# EAGLE schematic Send3 (EAGLE 6.5.0)

## Sheet 1 of 7
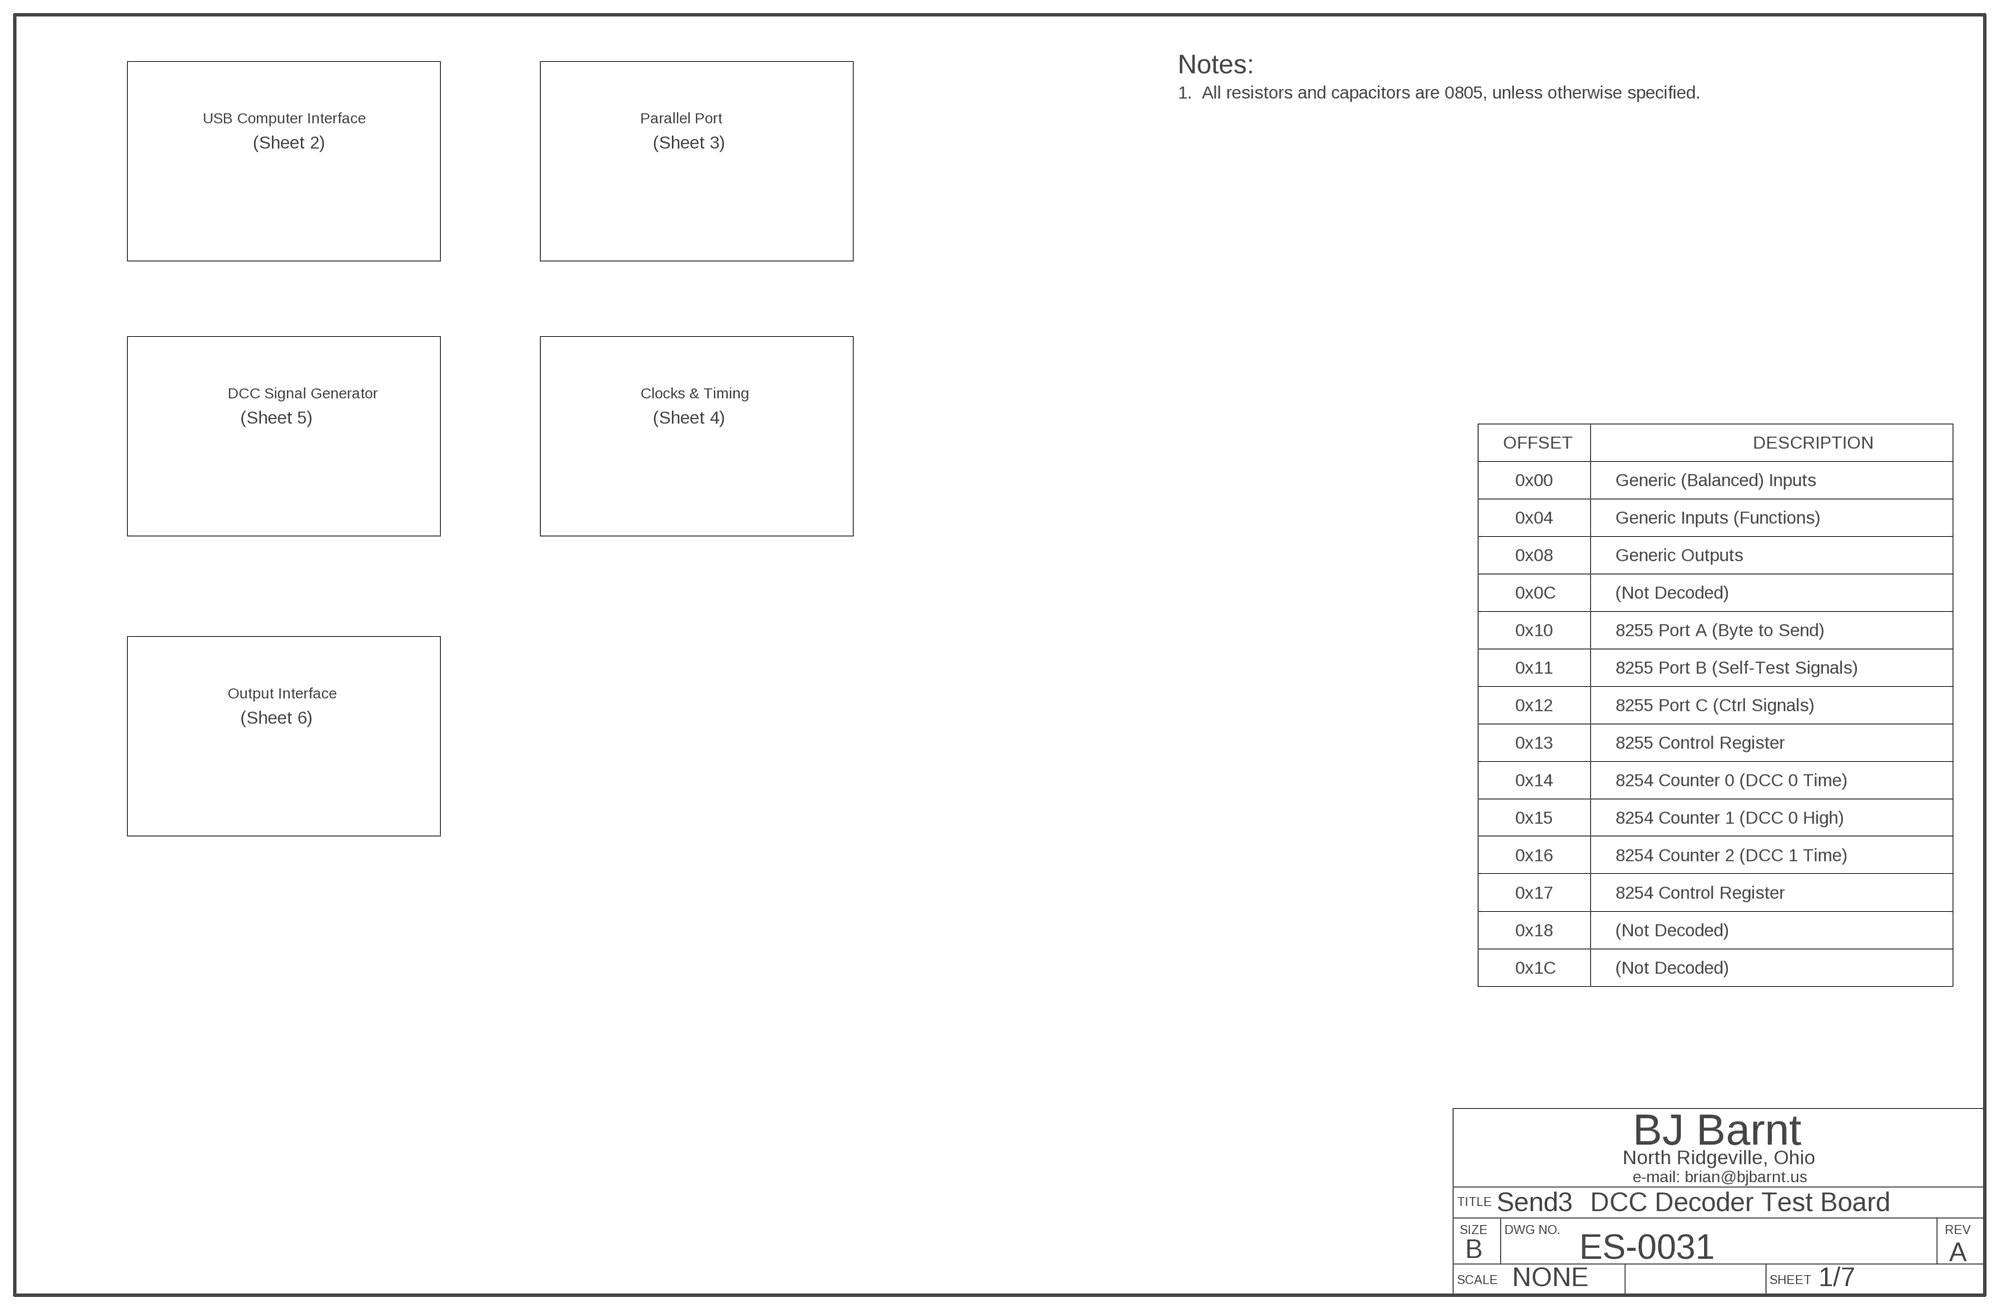
[diagram p0: schematic, sheet 1]

### Notes on the sheet
- Notes:
- 1.  All resistors and capacitors are 0805, unless otherwise specified.
- USB Computer Interface | Parallel Port
- (Sheet 2) | (Sheet 3)
- DCC Signal Generator | Clocks & Timing
- (Sheet 5) | (Sheet 4)
- OFFSET | DESCRIPTION
- 0x00 | Generic (Balanced) Inputs
- 0x04 | Generic Inputs (Functions)
- 0x08 | Generic Outputs
- 0x0C | (Not Decoded)
- 0x10 | 8255 Port A (Byte to Send)
- 0x11 | 8255 Port B (Self-Test Signals)
- Output Interface
- 0x12 | 8255 Port C (Ctrl Signals)
- (Sheet 6)
- 0x13 | 8255 Control Register
- 0x14 | 8254 Counter 0 (DCC 0 Time)
- 0x15 | 8254 Counter 1 (DCC 0 High)
- 0x16 | 8254 Counter 2 (DCC 1 Time)
- 0x17 | 8254 Control Register
- 0x18 | (Not Decoded)
- 0x1C | (Not Decoded)
- DCC Decoder Test Board
- ES-0031 | A

## Sheet 2 of 7
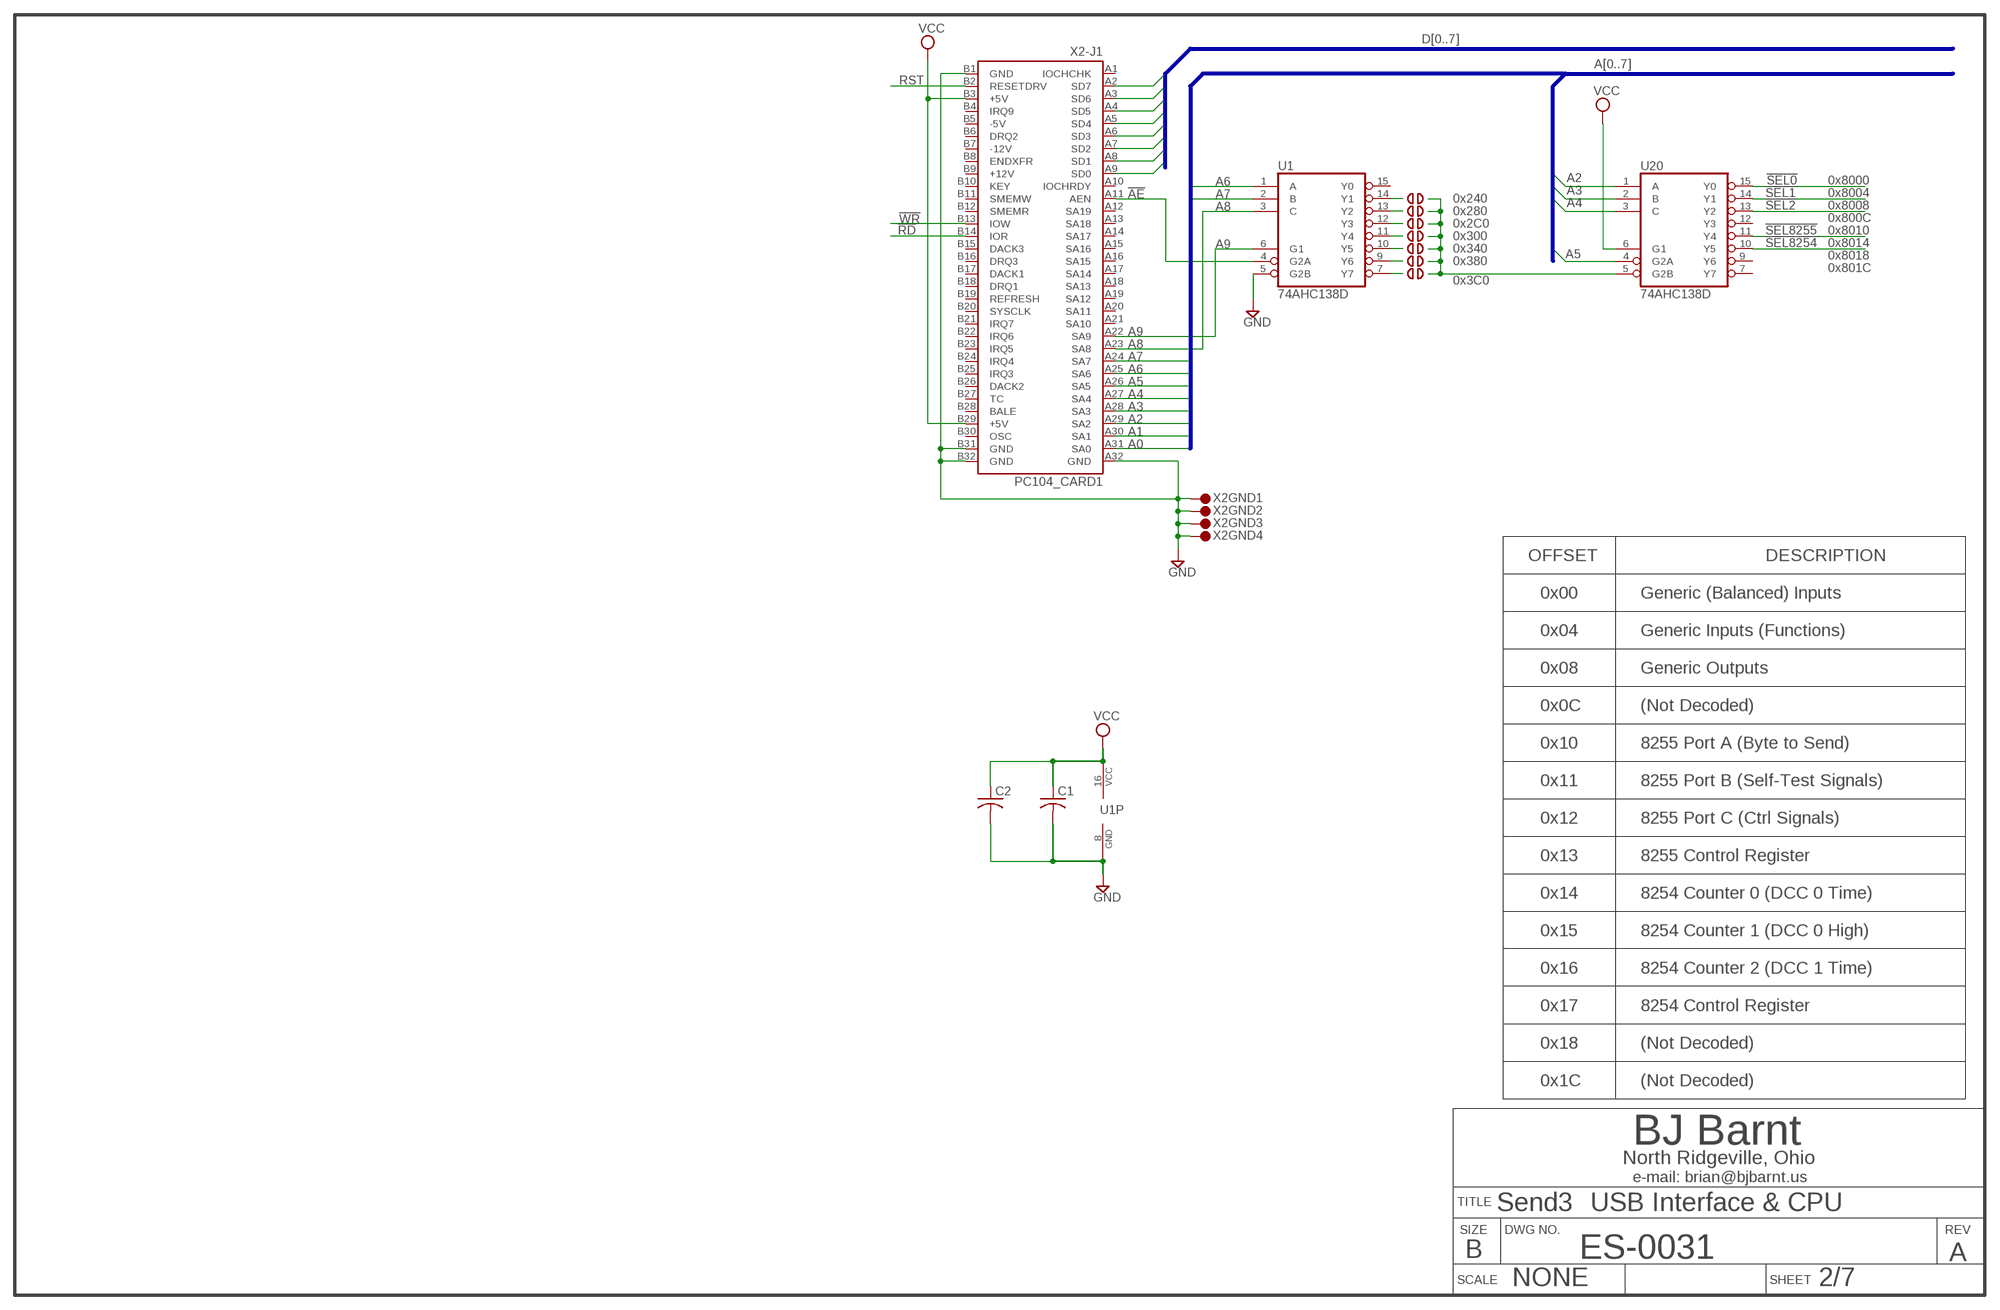
[diagram p1: schematic, sheet 2]

### Parts
C1  C-USC0805K  [C0805K]
C2  C-USC0805K  [C0805K]
JMPR2  JUMPER  [SOLDER_BRIDGE]
JMPR3  JUMPER  [SOLDER_BRIDGE]
JMPR4  JUMPER  [SOLDER_BRIDGE]
JMPR5  JUMPER  [SOLDER_BRIDGE]
JMPR6  JUMPER  [SOLDER_BRIDGE]
JMPR7  JUMPER  [SOLDER_BRIDGE]
JMPR8  JUMPER  [SOLDER_BRIDGE]
U1  74AHC138D  [SO16]
U20  74AHC138D  [SO16]
X2  PC104_CARD1  [PC104-STANDARD]

### Nets
!AE: U1.4(G2A) X2.A11(-J1:AEN)
!RD: X2.B14(-J1:IOR) ; also sheet 3,4
!SEL0: U20.15(Y0) ; also sheet 3
!SEL1: U20.14(Y1) ; also sheet 3
!SEL2: U20.13(Y2) ; also sheet 3
!SEL8254: U20.10(Y5) ; also sheet 4
!SEL8255: U20.11(Y4) ; also sheet 3
!WR: X2.B13(-J1:IOW) ; also sheet 3,4
A0: X2.A31(-J1:SA0) ; also sheet 3,4
A1: X2.A30(-J1:SA1) ; also sheet 3,4
A2: U20.1(A) X2.A29(-J1:SA2)
A3: U20.2(B) X2.A28(-J1:SA3)
A4: U20.3(C) X2.A27(-J1:SA4)
A5: U20.4(G2A) X2.A26(-J1:SA5)
A6: U1.1(A) X2.A25(-J1:SA6)
A7: U1.2(B) X2.A24(-J1:SA7)
A8: U1.3(C) X2.A23(-J1:SA8)
A9: U1.6(G1) X2.A22(-J1:SA9)
D0: X2.A9(-J1:SD0) ; also sheet 3,4,6
D1: X2.A8(-J1:SD1) ; also sheet 3,4,6
D2: X2.A7(-J1:SD2) ; also sheet 3,4,6
D3: X2.A6(-J1:SD3) ; also sheet 3,4,6
D4: X2.A5(-J1:SD4) ; also sheet 3,4,6
D5: X2.A4(-J1:SD5) ; also sheet 3,4,6
D6: X2.A3(-J1:SD6) ; also sheet 3,4,6
D7: X2.A2(-J1:SD7) ; also sheet 3,4,6
GND: C1.2 C2.2 U1.5(G2B) U1.8(GND) X2.A32(-J1:GND) X2.B1(-J1:GND) X2.B31(-J1:GND) X2.B32(-J1:GND) X2.GND@1 X2.GND@2 X2.GND@3 X2.GND@4 ; also sheet 3,4,5,6
N$2: JMPR2.P$1 U1.14(Y1)
N$3: JMPR3.P$1 U1.13(Y2)
N$4: JMPR4.P$1 U1.12(Y3)
N$6: JMPR5.P$1 U1.11(Y4)
N$7: JMPR6.P$1 U1.10(Y5)
N$8: JMPR7.P$1 U1.9(Y6)
N$11: JMPR8.P$1 U1.7(Y7)
N$12: JMPR2.P$2 JMPR3.P$2 JMPR4.P$2 JMPR5.P$2 JMPR6.P$2 JMPR7.P$2 JMPR8.P$2 U20.5(G2B)
RST: X2.B2(-J1:RESETDRV) ; also sheet 3
VCC: C1.1 C2.1 U1.16(VCC) U20.6(G1) X2.B3(-J1:+5V) X2.B29(-J1:+5V) ; also sheet 3,4,5,6
Unconnected: U1.15(Y0) U20.7(Y7) U20.9(Y6) U20.12(Y3) X2.A1(-J1:IOCHCHK) X2.A10(-J1:IOCHRDY) X2.A12(-J1:SA19) X2.A13(-J1:SA18) X2.A14(-J1:SA17) X2.A15(-J1:SA16) X2.A16(-J1:SA15) X2.A17(-J1:SA14) X2.A18(-J1:SA13) X2.A19(-J1:SA12) X2.A20(-J1:SA11) X2.A21(-J1:SA10) X2.B4(-J1:IRQ9) X2.B5(-J1:-5V) X2.B6(-J1:DRQ2) X2.B7(-J1:-12V) X2.B8(-J1:ENDXFR) X2.B9(-J1:+12V) X2.B10(-J1:KEY) X2.B11(-J1:SMEMW) X2.B12(-J1:SMEMR) X2.B15(-J1:DACK3) X2.B16(-J1:DRQ3) X2.B17(-J1:DACK1) X2.B18(-J1:DRQ1) X2.B19(-J1:REFRESH) X2.B20(-J1:SYSCLK) X2.B21(-J1:IRQ7) X2.B22(-J1:IRQ6) X2.B23(-J1:IRQ5) X2.B24(-J1:IRQ4) X2.B25(-J1:IRQ3) X2.B26(-J1:DACK2) X2.B27(-J1:TC) X2.B28(-J1:BALE) X2.B30(-J1:OSC) X2.C0(-J2:0V) X2.C1(-J2:SBHE) X2.C2(-J2:LA23) X2.C3(-J2:LA22) X2.C4(-J2:LA21) X2.C5(-J2:LA20) X2.C6(-J2:LA19) X2.C7(-J2:LA18) X2.C8(-J2:LA17) X2.C9(-J2:MEMR) X2.C10(-J2:MEMW) X2.C11(-J2:SD8) X2.C12(-J2:SD9) X2.C13(-J2:SD10) X2.C14(-J2:SD11) X2.C15(-J2:SD12) X2.C16(-J2:SD13) X2.C17(-J2:SD14) X2.C18(-J2:SD15) X2.C19(-J2:KEY) X2.D0(-J2:0V) X2.D1(-J2:MEMCS16) X2.D2(-J2:IOCS16) X2.D3(-J2:IRQ10) X2.D4(-J2:IRQ11) X2.D5(-J2:IRQ12) X2.D6(-J2:IRQ15) X2.D7(-J2:IRQ14) X2.D8(-J2:DACK0) X2.D9(-J2:DRQ0) X2.D10(-J2:DACK5) X2.D11(-J2:DRQ5) X2.D12(-J2:DACK6) X2.D13(-J2:DRQ6) X2.D14(-J2:DACK7) X2.D15(-J2:DRQ7) X2.D16(-J2:+5V) X2.D17(-J2:MASTER) X2.D18(-J2:0V) X2.D19(-J2:0V)

### Buses
D[0..7]
A[0..7]

### Notes on the sheet
- 0x8000
- 0x240 | 0x8004
- 0x280 | 0x8008
- 0x2C0 | 0x800C
- 0x300 | 0x8010
- 0x340 | 0x8014
- 0x380 | 0x8018
- 0x801C
- 0x3C0
- OFFSET | DESCRIPTION
- 0x00 | Generic (Balanced) Inputs
- 0x04 | Generic Inputs (Functions)
- 0x08 | Generic Outputs
- 0x0C | (Not Decoded)
- 0x10 | 8255 Port A (Byte to Send)
- 0x11 | 8255 Port B (Self-Test Signals)
- 0x12 | 8255 Port C (Ctrl Signals)
- 0x13 | 8255 Control Register
- 0x14 | 8254 Counter 0 (DCC 0 Time)
- 0x15 | 8254 Counter 1 (DCC 0 High)
- 0x16 | 8254 Counter 2 (DCC 1 Time)
- 0x17 | 8254 Control Register
- 0x18 | (Not Decoded)
- 0x1C | (Not Decoded)
- USB Interface & CPU
- ES-0031 | A

## Sheet 3 of 7
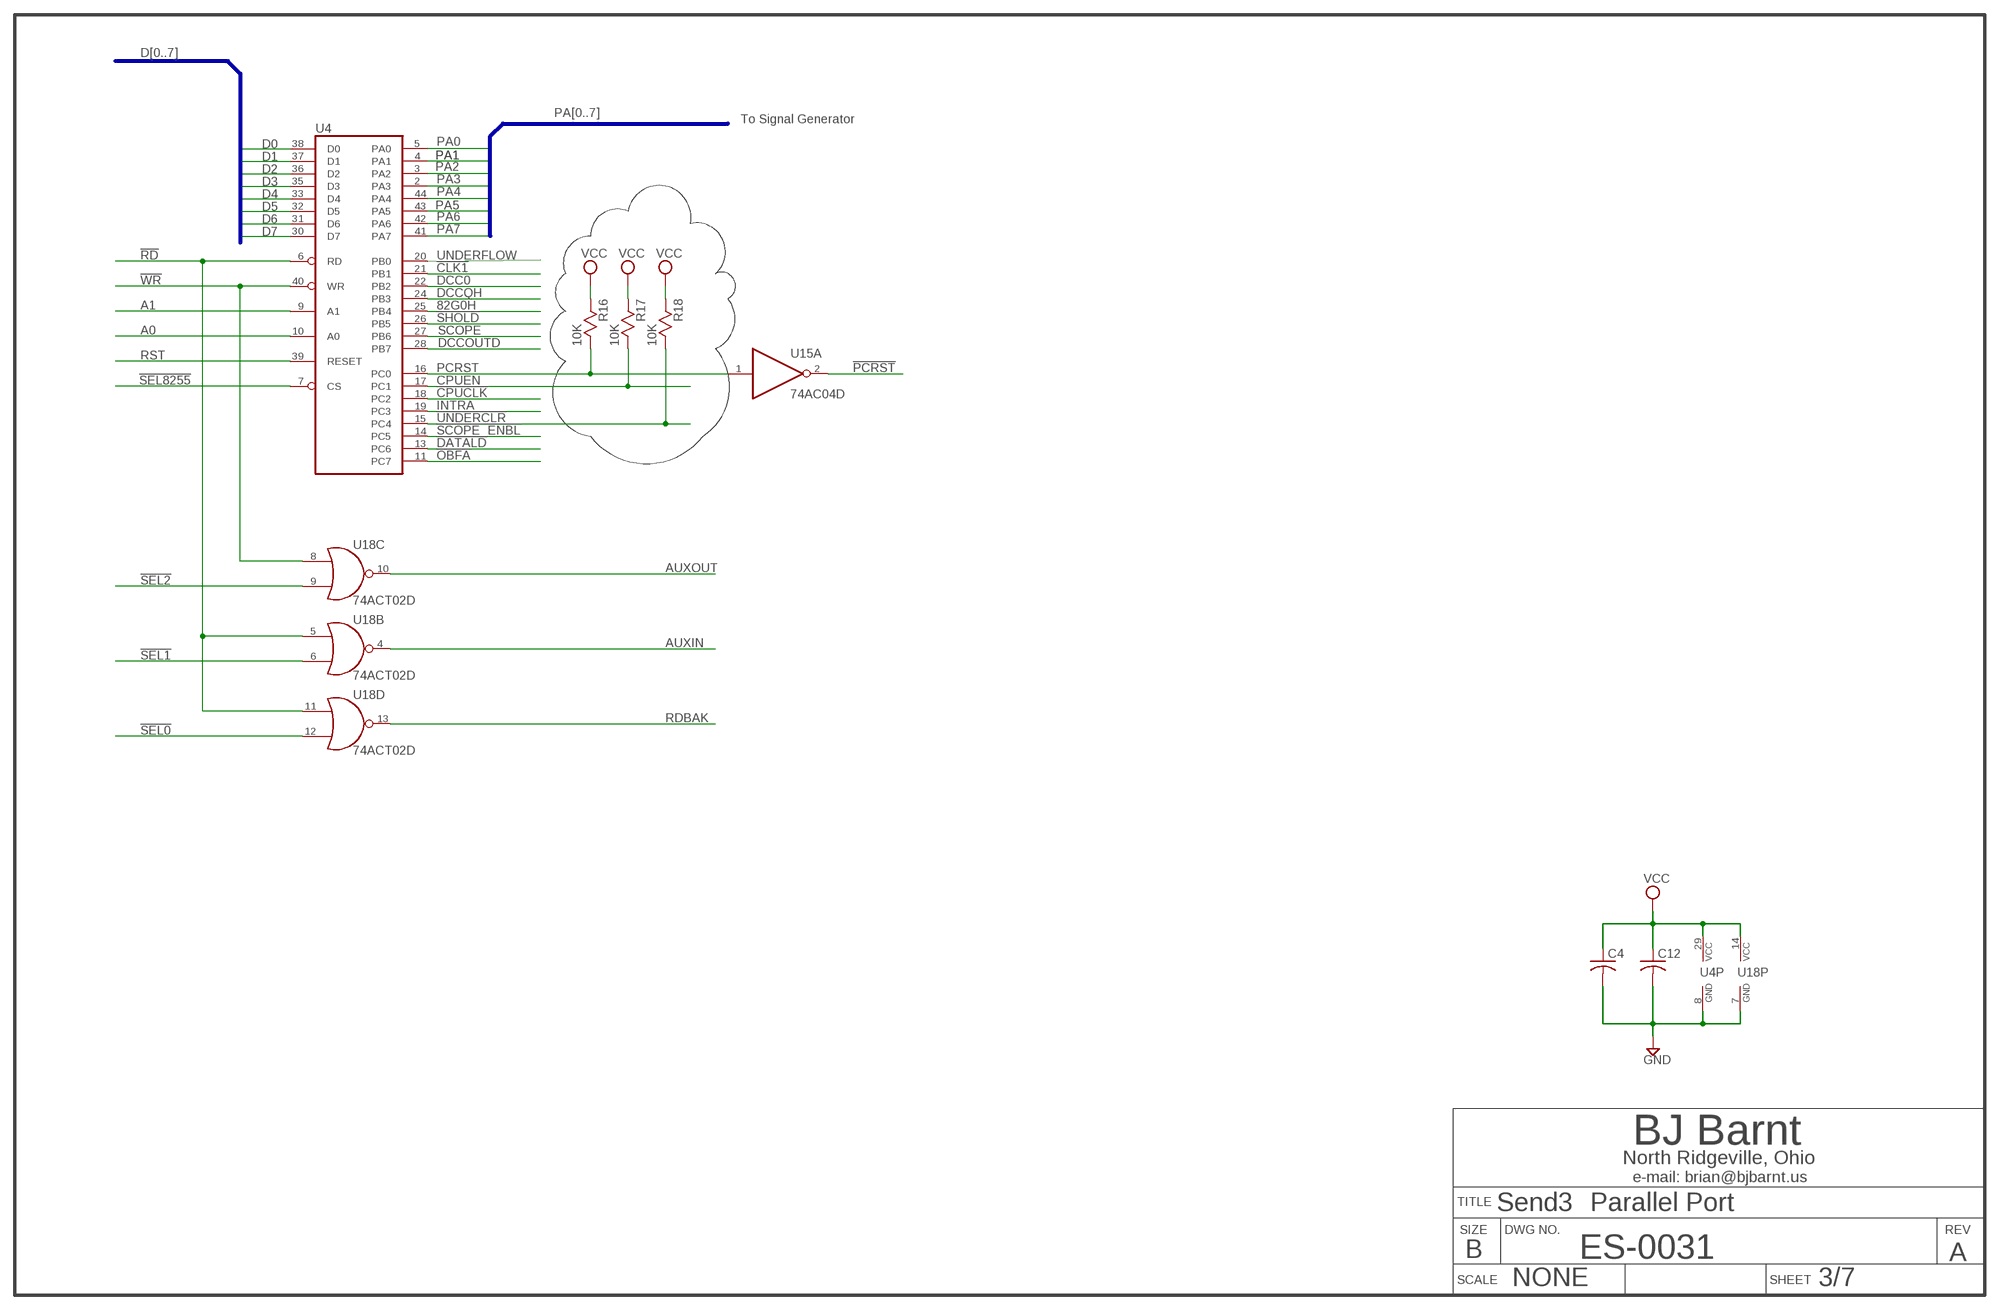
[diagram p2: schematic, sheet 3]

### Parts
C4  C-USC0805K  [C0805K]
C12  C-USC0805K  [C0805K]
R16  10K  R-US_0805W  [R0805W]
R17  10K  R-US_0805W  [R0805W]
R18  10K  R-US_0805W  [R0805W]
U4  8255A-S  [PLCC44]
U15  74AC04D  [SO14]
U18  74ACT02D  [SO14]

### Nets
82G0H: U4.25(PB4) ; also sheet 4,5
!CLK1: U4.21(PB1) ; also sheet 4,5
!CPUCLK: U4.18(PC2) ; also sheet 4
!DATALD: U4.13(PC6) ; also sheet 5
!OBFA: U4.11(PC7) ; also sheet 5
!PCRST: U15.2(A:O) ; also sheet 4,5,6
!RD: U4.6(RD) U18.5(B:I0) U18.11(D:I0) ; also sheet 2,4
!SCOPE_ENBL: U4.14(PC5) ; also sheet 5
!SEL0: U18.12(D:I1) ; also sheet 2
!SEL1: U18.6(B:I1) ; also sheet 2
!SEL2: U18.9(C:I1) ; also sheet 2
!SEL8255: U4.7(CS) ; also sheet 2
!SHOLD: U4.26(PB5) ; also sheet 5
!UNDERCLR: R18.2 U4.15(PC4) ; also sheet 5
!WR: U4.40(WR) U18.8(C:I0) ; also sheet 2,4
A0: U4.10(A0) ; also sheet 2,4
A1: U4.9(A1) ; also sheet 2,4
AUXIN: U18.4(B:O) ; also sheet 6
AUXOUT: U18.10(C:O) ; also sheet 6
CPUEN: R17.2 U4.17(PC1) ; also sheet 4
D0: U4.38(D0) ; also sheet 2,4,6
D1: U4.37(D1) ; also sheet 2,4,6
D2: U4.36(D2) ; also sheet 2,4,6
D3: U4.35(D3) ; also sheet 2,4,6
D4: U4.33(D4) ; also sheet 2,4,6
D5: U4.32(D5) ; also sheet 2,4,6
D6: U4.31(D6) ; also sheet 2,4,6
D7: U4.30(D7) ; also sheet 2,4,6
DCC0: U4.22(PB2) ; also sheet 4
DCCOUTD: U4.28(PB7) ; also sheet 5,6
DCCQH: U4.24(PB3) ; also sheet 4,5
GND: C4.2 C12.2 U4.8(GND) U18.7(P:GND) ; also sheet 2,4,5,6
INTRA: U4.19(PC3)
PA0: U4.5(PA0) ; also sheet 5
PA1: U4.4(PA1) ; also sheet 5
PA2: U4.3(PA2) ; also sheet 5
PA3: U4.2(PA3) ; also sheet 5
PA4: U4.44(PA4) ; also sheet 5
PA5: U4.43(PA5) ; also sheet 5
PA6: U4.42(PA6) ; also sheet 5
PA7: U4.41(PA7) ; also sheet 5
PCRST: R16.2 U4.16(PC0) U15.1(A:I)
RDBAK: U18.13(D:O) ; also sheet 6
RST: U4.39(RESET) ; also sheet 2
SCOPE: U4.27(PB6) ; also sheet 5,6
UNDERFLOW: U4.20(PB0) ; also sheet 5
VCC: C4.1 C12.1 R16.1 R17.1 R18.1 U4.29(VCC) U18.14(P:VCC) ; also sheet 2,4,5,6
Unconnected: U15.12(F:O) U15.13(F:I) U18.1(A:O) U18.2(A:I0) U18.3(A:I1)

### Buses
D[0..7]
PA[0..7]

### Notes on the sheet
- To Signal Generator
- Parallel Port
- ES-0031 | A

## Sheet 4 of 7
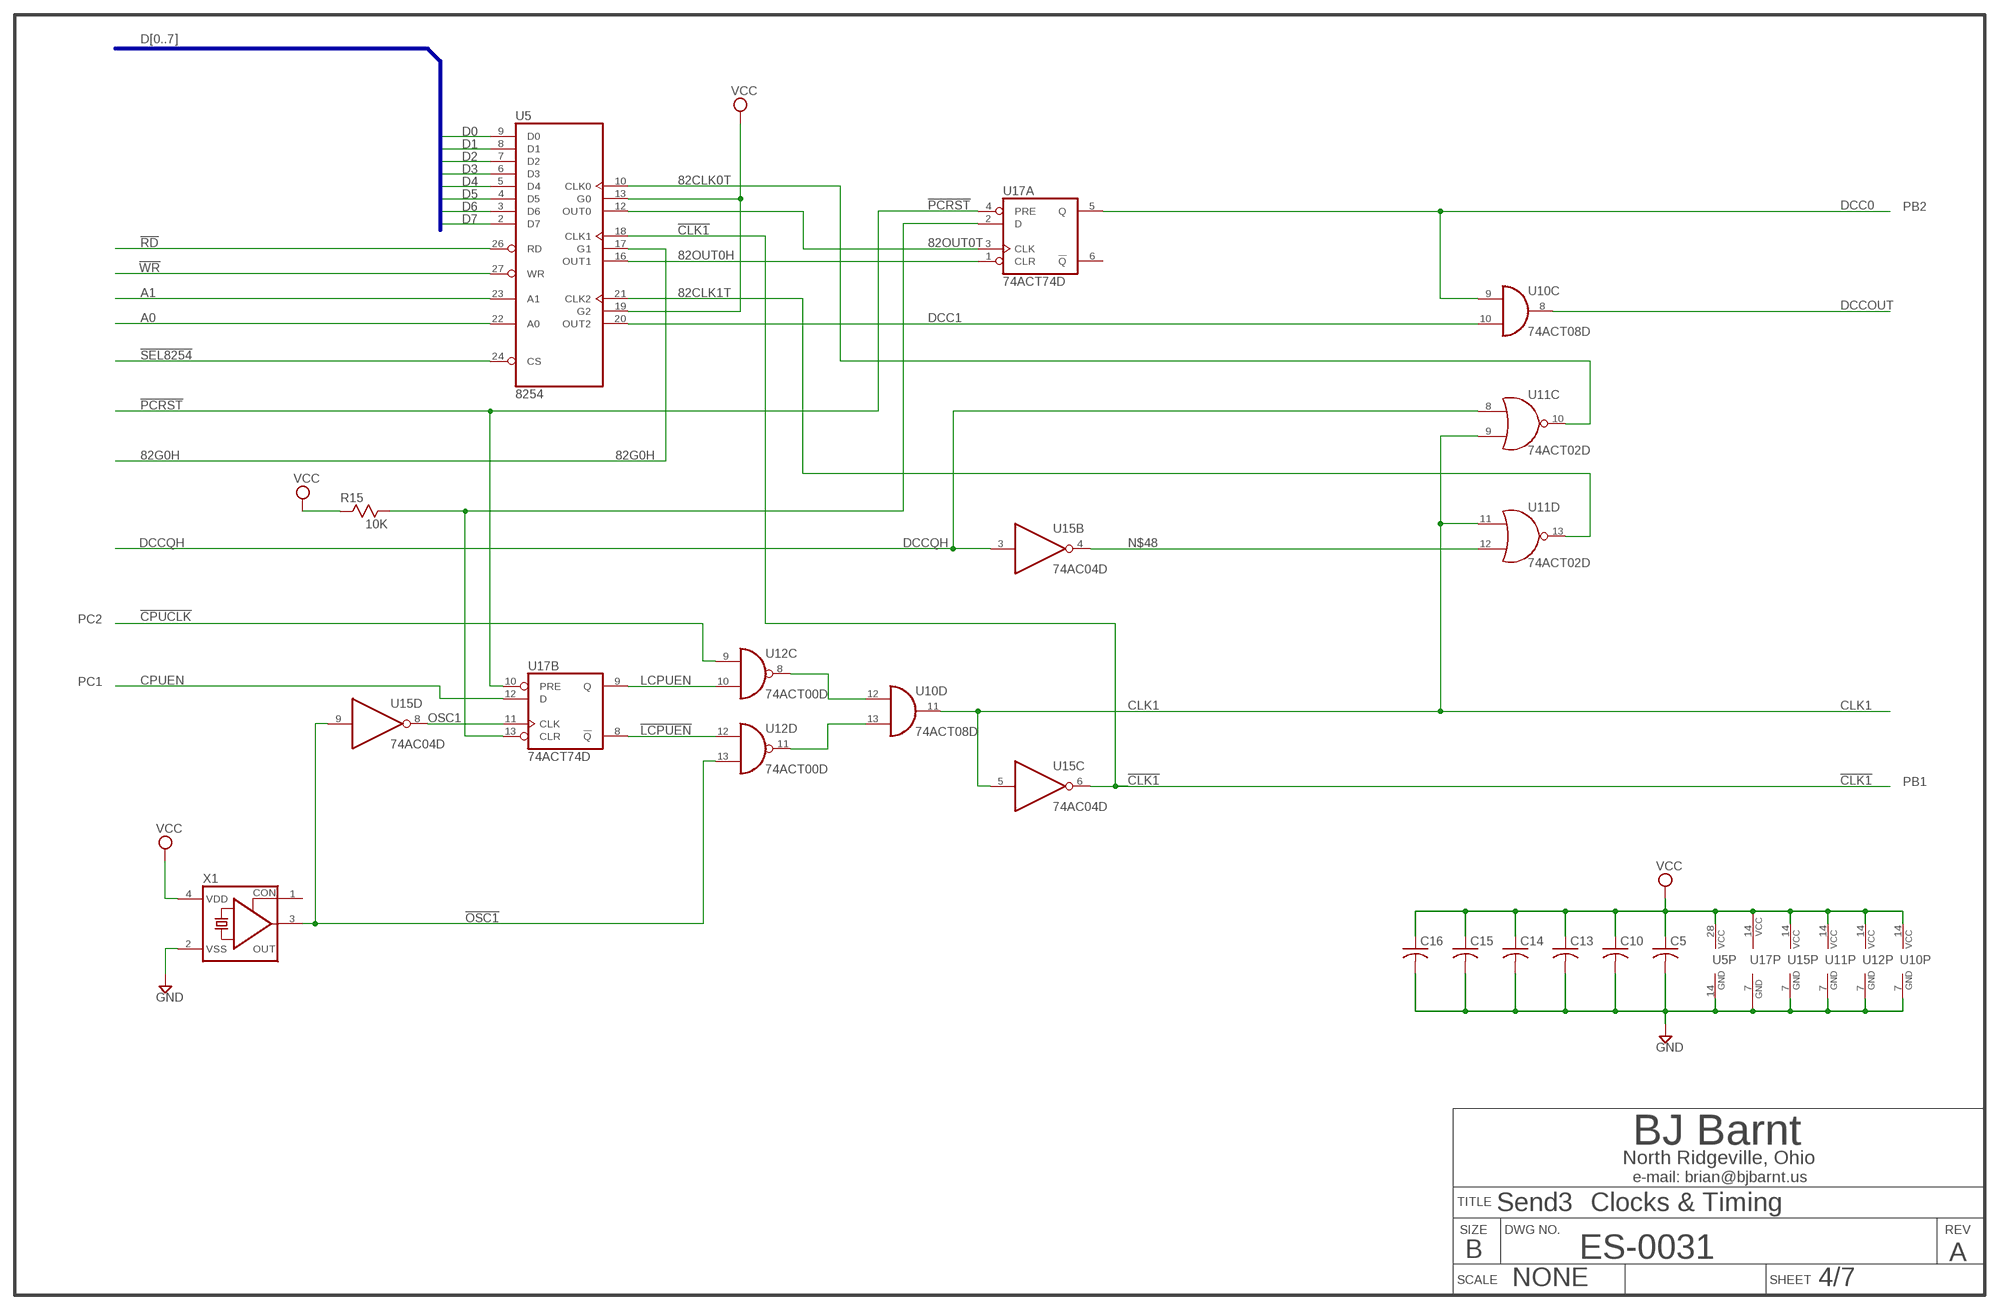
[diagram p3: schematic, sheet 4]

### Parts
C5  C-USC0805K  [C0805K]
C10  C-USC0805K  [C0805K]
C13  C-USC0805K  [C0805K]
C14  C-USC0805K  [C0805K]
C15  C-USC0805K  [C0805K]
C16  C-USC0805K  [C0805K]
R15  10K  R-US_0805W  [R0805W]
U5  8254  [PLCC28S]
U10  74ACT08D  74AC08D  [SO14]
U11  74ACT02D  74AC02D  [SO14]
U12  74ACT00D  74AC00D  [SO14]
U17  74ACT74D  7474D  [SO14]
X1  CRYSTAL_RES-1100S  [1100S]

### Nets
82CLK0T: U5.10(CLK0) U11.10(C:O)
82CLK1T: U5.21(CLK2) U11.13(D:O)
82G0H: U5.17(G1) ; also sheet 3,5
82OUT0H: U5.16(OUT1) U17.1(A:CLR)
82OUT0T: U5.12(OUT0) U17.3(A:CLK)
!CLK1: U5.18(CLK1) U15.6(C:O) ; also sheet 3,5
!CPUCLK: U12.9(C:I0) ; also sheet 3
!LCPUEN: U12.12(D:I0) U17.8(B:!Q)
!OSC1: U12.13(D:I1) U15.9(D:I) X1.3(OUT)
!PCRST: U17.4(A:PRE) U17.10(B:PRE) ; also sheet 3,5,6
!RD: U5.26(RD) ; also sheet 2,3
!SEL8254: U5.24(CS) ; also sheet 2
!WR: U5.27(WR) ; also sheet 2,3
A0: U5.22(A0) ; also sheet 2,3
A1: U5.23(A1) ; also sheet 2,3
CLK1: U10.11(D:O) U11.9(C:I1) U11.11(D:I0) U15.5(C:I) ; also sheet 5
CPUEN: U17.12(B:D) ; also sheet 3
D0: U5.9(D0) ; also sheet 2,3,6
D1: U5.8(D1) ; also sheet 2,3,6
D2: U5.7(D2) ; also sheet 2,3,6
D3: U5.6(D3) ; also sheet 2,3,6
D4: U5.5(D4) ; also sheet 2,3,6
D5: U5.4(D5) ; also sheet 2,3,6
D6: U5.3(D6) ; also sheet 2,3,6
D7: U5.2(D7) ; also sheet 2,3,6
DCC0: U10.9(C:I0) U17.5(A:Q) ; also sheet 3
DCC1: U5.20(OUT2) U10.10(C:I1)
DCCOUT: U10.8(C:O) ; also sheet 5
DCCQH: U11.8(C:I0) U15.3(B:I) ; also sheet 3,5
GND: C5.2 C10.2 C13.2 C14.2 C15.2 C16.2 U5.14(GND) U10.7(P:GND) U11.7(P:GND) U12.7(P:GND) U15.7(P:GND) U17.7(P:GND) X1.2(VSS) ; also sheet 2,3,5,6
LCPUEN: U12.10(C:I1) U17.9(B:Q)
N$42: U10.12(D:I0) U12.8(C:O)
N$43: U10.13(D:I1) U12.11(D:O)
N$48: U11.12(D:I1) U15.4(B:O)
OSC1: U15.8(D:O) U17.11(B:CLK)
PU403: R15.2 U17.2(A:D) U17.13(B:CLR)
VCC: C5.1 C10.1 C13.1 C14.1 C15.1 C16.1 R15.1 U5.13(G0) U5.19(G2) U5.28(VCC) U10.14(P:VCC) U11.14(P:VCC) U12.14(P:VCC) U15.14(P:VCC) U17.14(P:VCC) X1.4(VDD) ; also sheet 2,3,5,6
Unconnected: U17.6(A:!Q) X1.1(CON)

### Buses
D[0..7]

### Notes on the sheet
- PB2
- PC2
- PC1
- PB1
- Clocks & Timing
- ES-0031 | A

## Sheet 5 of 7
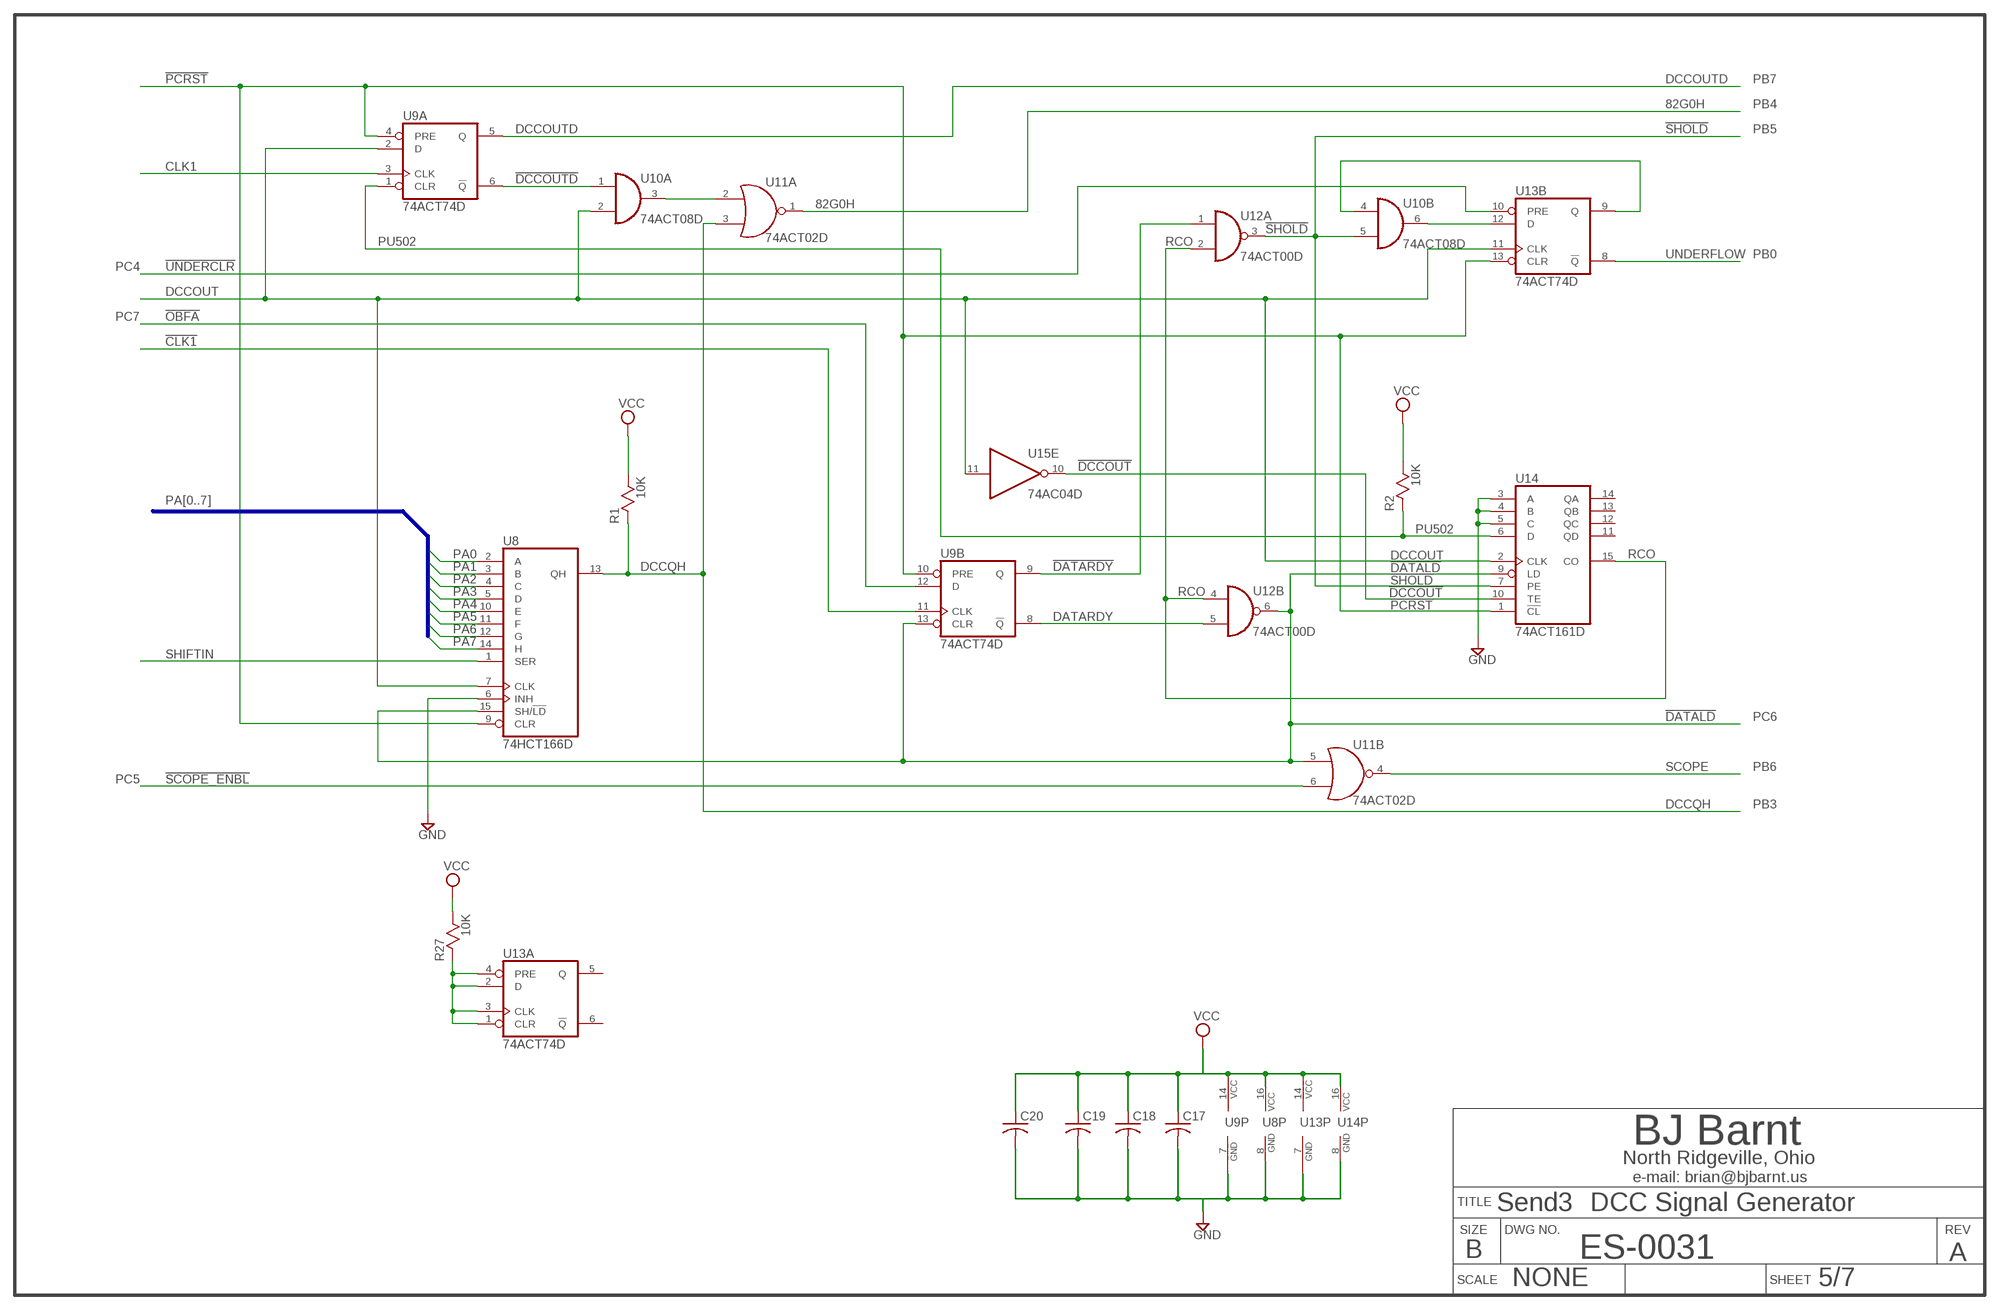
[diagram p4: schematic, sheet 5]

### Parts
C17  C-USC0805K  [C0805K]
C18  C-USC0805K  [C0805K]
C19  C-USC0805K  [C0805K]
C20  C-USC0805K  [C0805K]
R1  10K  R-US_0805W  [R0805W]
R2  10K  R-US_0805W  [R0805W]
R27  10K  R-US_0805W  [R0805W]
U8  74HCT166D  [SO16]
U9  74ACT74D  7474D  [SO14]
U13  74ACT74D  7474D  [SO14]
U14  74ACT161D  74161D  [SO16]

### Nets
82G0H: U11.1(A:O) ; also sheet 3,4
!CLK1: U9.11(B:CLK) ; also sheet 3,4
!DATALD: U8.15(SH/!LD) U9.13(B:CLR) U11.5(B:I0) U12.6(B:O) U14.9(LD) ; also sheet 3
!DATARDY: U9.9(B:Q) U12.1(A:I0)
!DCCOUT: U14.10(TE) U15.10(E:O)
!DCCOUTD: U9.6(A:!Q) U10.1(A:I0)
!OBFA: U9.12(B:D) ; also sheet 3
!PCRST: U8.9(CLR) U9.4(A:PRE) U9.10(B:PRE) U13.13(B:CLR) U14.1(!CL) ; also sheet 3,4,6
!SCOPE_ENBL: U11.6(B:I1) ; also sheet 3
!SHOLD: U10.5(B:I1) U12.3(A:O) U14.7(PE) ; also sheet 3
!UNDERCLR: U13.10(B:PRE) ; also sheet 3
CLK1: U9.3(A:CLK) ; also sheet 4
DATARDY: U9.8(B:!Q) U12.5(B:I1)
DCCOUT: U8.7(CLK) U9.2(A:D) U10.2(A:I1) U13.11(B:CLK) U14.2(CLK) U15.11(E:I) ; also sheet 4
DCCOUTD: U9.5(A:Q) ; also sheet 3,6
DCCQH: R1.1 U8.13(QH) U11.3(A:I1) ; also sheet 3,4
GND: C17.2 C18.2 C19.2 C20.2 U8.6(INH) U8.8(GND) U9.7(P:GND) U13.7(P:GND) U14.3(A) U14.4(B) U14.5(C) U14.8(GND) ; also sheet 2,3,4,6
N$5: U10.3(A:O) U11.2(A:I0)
N$9: U10.6(B:O) U13.12(B:D)
N$10: U10.4(B:I0) U13.9(B:Q)
N$50: R27.1 U13.1(A:CLR) U13.2(A:D) U13.3(A:CLK) U13.4(A:PRE)
PA0: U8.2(A) ; also sheet 3
PA1: U8.3(B) ; also sheet 3
PA2: U8.4(C) ; also sheet 3
PA3: U8.5(D) ; also sheet 3
PA4: U8.10(E) ; also sheet 3
PA5: U8.11(F) ; also sheet 3
PA6: U8.12(G) ; also sheet 3
PA7: U8.14(H) ; also sheet 3
PU502: R2.1 U9.1(A:CLR) U14.6(D)
RCO: U12.2(A:I1) U12.4(B:I0) U14.15(CO)
SCOPE: U11.4(B:O) ; also sheet 3,6
SHIFTIN: U8.1(SER) ; also sheet 6
UNDERFLOW: U13.8(B:!Q) ; also sheet 3
VCC: C17.1 C18.1 C19.1 C20.1 R1.2 R2.2 R27.2 U8.16(VCC) U9.14(P:VCC) U13.14(P:VCC) U14.16(VCC) ; also sheet 2,3,4,6
Unconnected: U13.5(A:Q) U13.6(A:!Q) U14.11(QD) U14.12(QC) U14.13(QB) U14.14(QA)

### Buses
PA[0..7]

### Notes on the sheet
- PB7
- PB4
- PB5
- PB0
- PC4
- PC7
- PC6
- PB6
- PC5
- PB3
- DCC Signal Generator
- ES-0031 | A

## Sheet 6 of 7
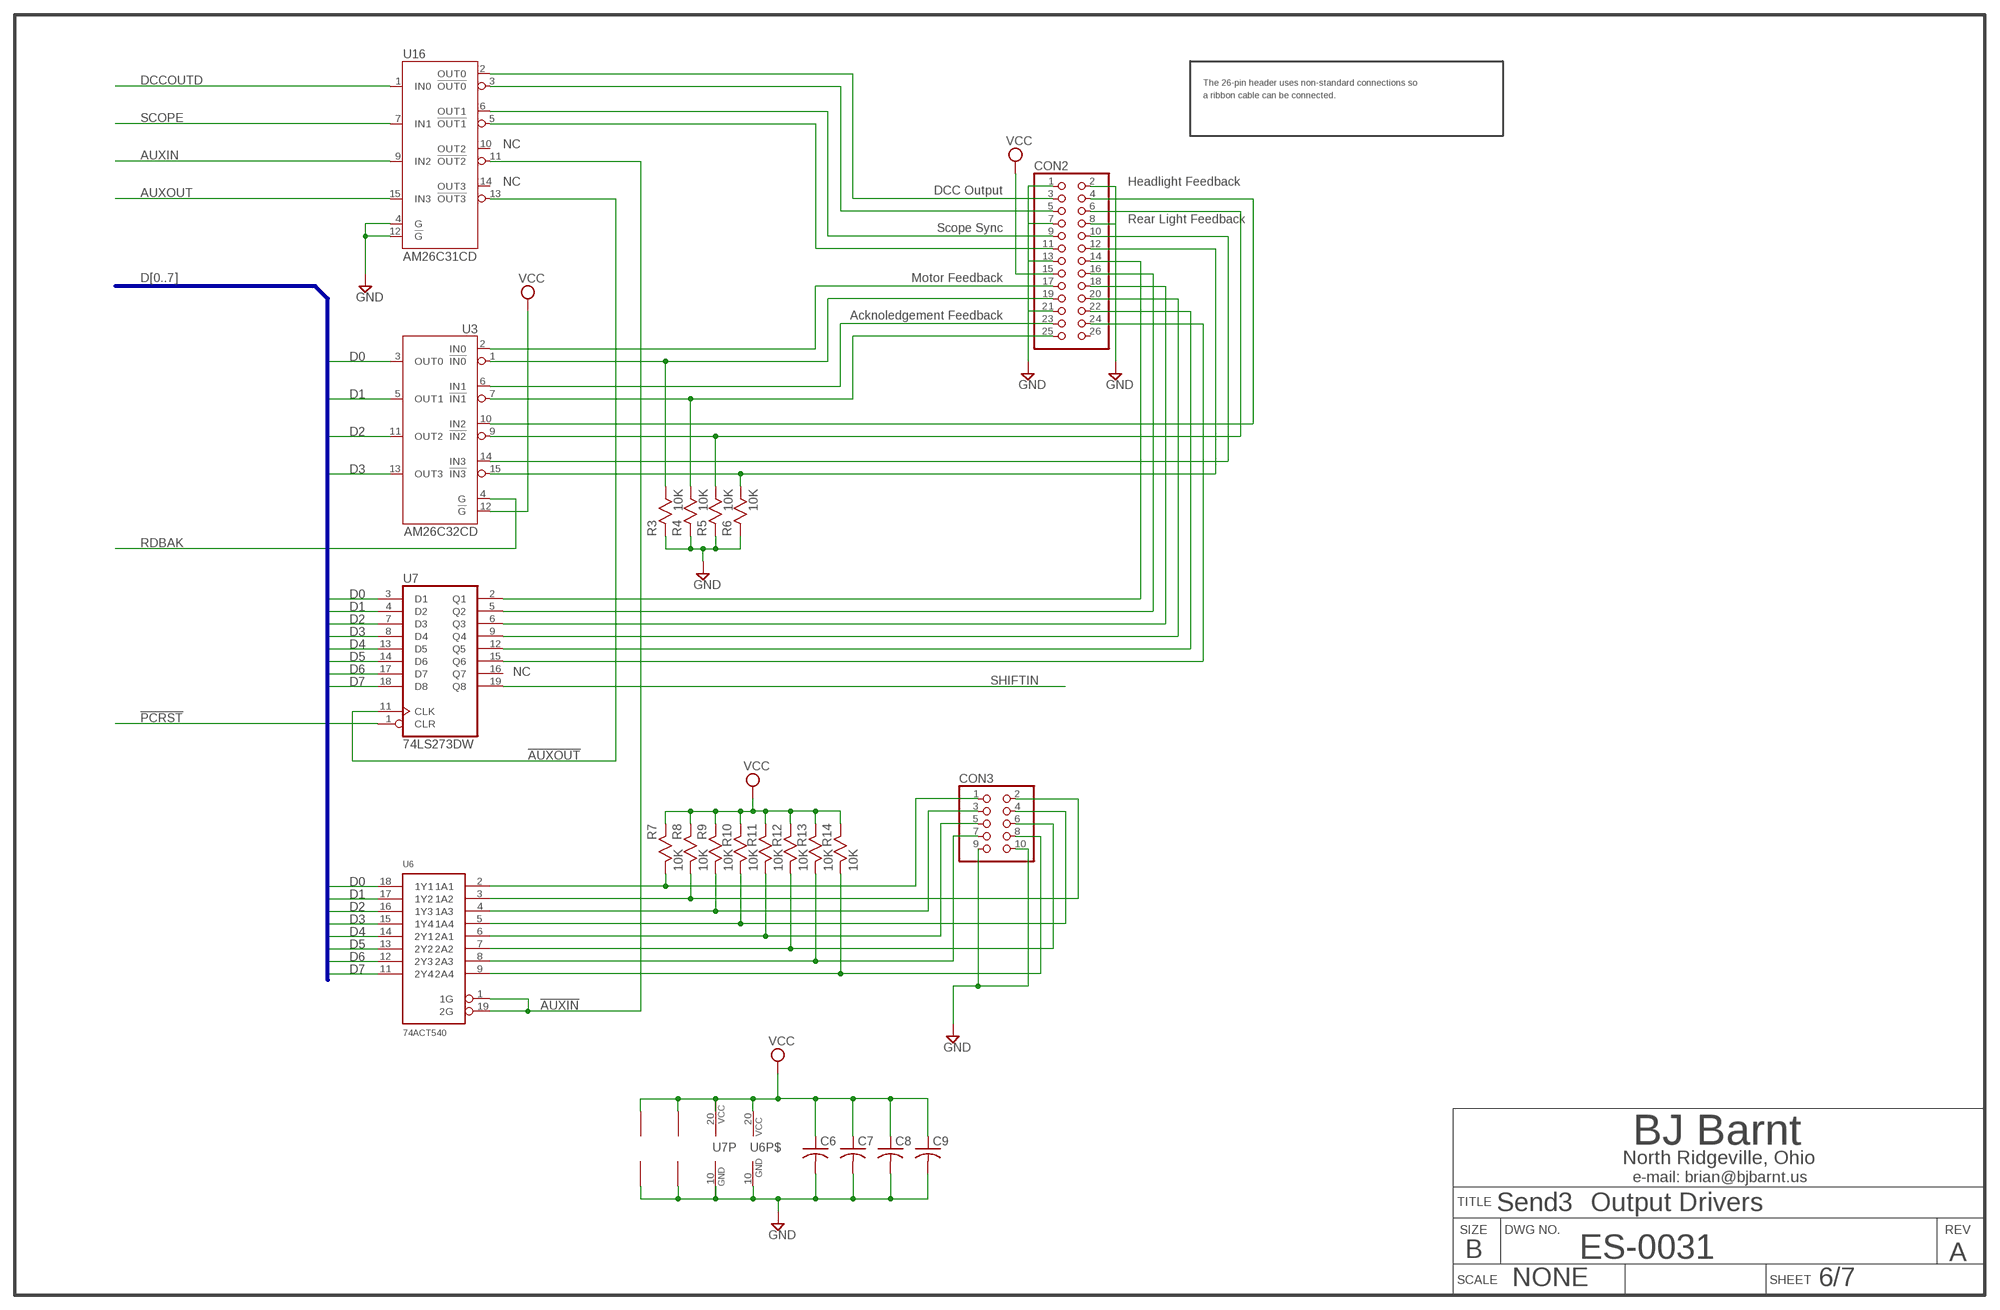
[diagram p5: schematic, sheet 6]

### Parts
C6  C-USC0805K  [C0805K]
C7  C-USC0805K  [C0805K]
C8  C-USC0805K  [C0805K]
C9  C-USC0805K  [C0805K]
CON2  PINHD-2X13  [2X13]
CON3  PINHD-2X5  [2X05]
R3  10K  R-US_0805W  [R0805W]
R4  10K  R-US_0805W  [R0805W]
R5  10K  R-US_0805W  [R0805W]
R6  10K  R-US_0805W  [R0805W]
R7  10K  R-US_0805W  [R0805W]
R8  10K  R-US_0805W  [R0805W]
R9  10K  R-US_0805W  [R0805W]
R10  10K  R-US_0805W  [R0805W]
R11  10K  R-US_0805W  [R0805W]
R12  10K  R-US_0805W  [R0805W]
R13  10K  R-US_0805W  [R0805W]
R14  10K  R-US_0805W  [R0805W]
U3  AM26C32CD  [SO16]
U6  74ACT540  74540  [SO20W]
U7  74LS273DW  [SO20W]
U16  AM26C31CD  [SO16]

### Nets
!ACK_FEEDBACK: CON2.25 R4.2 U3.7(!IN1)
!AUXIN: U6.1(1G) U6.19(2G) U16.11(!OUT2)
!AUXOUT: U7.11(CLK) U16.13(!OUT3)
!DCC_OUT: CON2.5 U16.3(!OUT0)
!HL_FEEDBACK: CON2.6 R5.2 U3.9(!IN2)
!MOTOR_FEEDBACK: CON2.19 R3.2 U3.1(!IN0)
!PCRST: U7.1(CLR) ; also sheet 3,4,5
!RL_FEEDBACK: CON2.12 R6.2 U3.15(!IN3)
!SCOPE_SYNC: CON2.11 U16.5(!OUT1)
ACK_FEEDBACK: CON2.23 U3.6(IN1)
AUXIN: U16.9(IN2) ; also sheet 3
AUXOUT: U16.15(IN3) ; also sheet 3
D0: U3.3(OUT0) U6.18(1Y1) U7.3(D1) ; also sheet 2,3,4
D1: U3.5(OUT1) U6.17(1Y2) U7.4(D2) ; also sheet 2,3,4
D2: U3.11(OUT2) U6.16(1Y3) U7.7(D3) ; also sheet 2,3,4
D3: U3.13(OUT3) U6.15(1Y4) U7.8(D4) ; also sheet 2,3,4
D4: U6.14(2Y1) U7.13(D5) ; also sheet 2,3,4
D5: U6.13(2Y2) U7.14(D6) ; also sheet 2,3,4
D6: U6.12(2Y3) U7.17(D7) ; also sheet 2,3,4
D7: U6.11(2Y4) U7.18(D8) ; also sheet 2,3,4
DCC_OUT: CON2.3 U16.2(OUT0)
DCCOUTD: U16.1(IN0) ; also sheet 3,5
F1: CON3.1 R7.2 U6.2(1A1)
F2: CON3.2 R8.2 U6.3(1A2)
F3: CON3.3 R9.2 U6.4(1A3)
F4: CON3.4 R10.2 U6.5(1A4)
F5: CON3.5 R11.2 U6.6(2A1)
F6: CON3.6 R12.2 U6.7(2A2)
F7: CON3.7 R13.2 U6.8(2A3)
F8: CON3.8 R14.2 U6.9(2A4)
GND: C6.2 C7.2 C8.2 C9.2 CON2.1 CON2.2 CON2.7 CON2.8 CON2.13 CON2.21 CON3.9 CON3.10 R3.1 R4.1 R5.1 R6.1 U3.8(GND) U6.10(GND) U7.10(GND) U16.4(G) U16.8(GND) U16.12(!G) ; also sheet 2,3,4,5
HL_FEEDBACK: CON2.4 U3.10(IN2)
MOTOR_FEEDBACK: CON2.17 U3.2(IN0)
N$16: CON2.14 U7.2(Q1)
N$17: CON2.16 U7.5(Q2)
N$18: CON2.18 U7.6(Q3)
N$19: CON2.20 U7.9(Q4)
N$20: CON2.22 U7.12(Q5)
N$21: CON2.24 U7.15(Q6)
RDBAK: U3.4(G) ; also sheet 3
RL_FEEDBACK: CON2.10 U3.14(IN3)
SCOPE: U16.7(IN1) ; also sheet 3,5
SCOPE_SYNC: CON2.9 U16.6(OUT1)
SHIFTIN: U7.19(Q8) ; also sheet 5
VCC: C6.1 C7.1 C8.1 C9.1 CON2.15 R7.1 R8.1 R9.1 R10.1 R11.1 R12.1 R13.1 R14.1 U3.12(!G) U3.16(VCC) U6.20(VCC) U7.20(VCC) U16.16(VCC) ; also sheet 2,3,4,5
Unconnected: CON2.26 U7.16(Q7) U16.10(OUT2) U16.14(OUT3)

### Buses
D[0..7]

### Notes on the sheet
- The 26-pin header uses non-standard connections so
- a ribbon cable can be connected.
- NC
- NC | DCC Output | Headlight Feedback
- Scope Sync | Rear Light Feedback
- Motor Feedback
- Acknoledgement Feedback
- NC
- Output Drivers
- ES-0031 | A

## Sheet 7 of 7
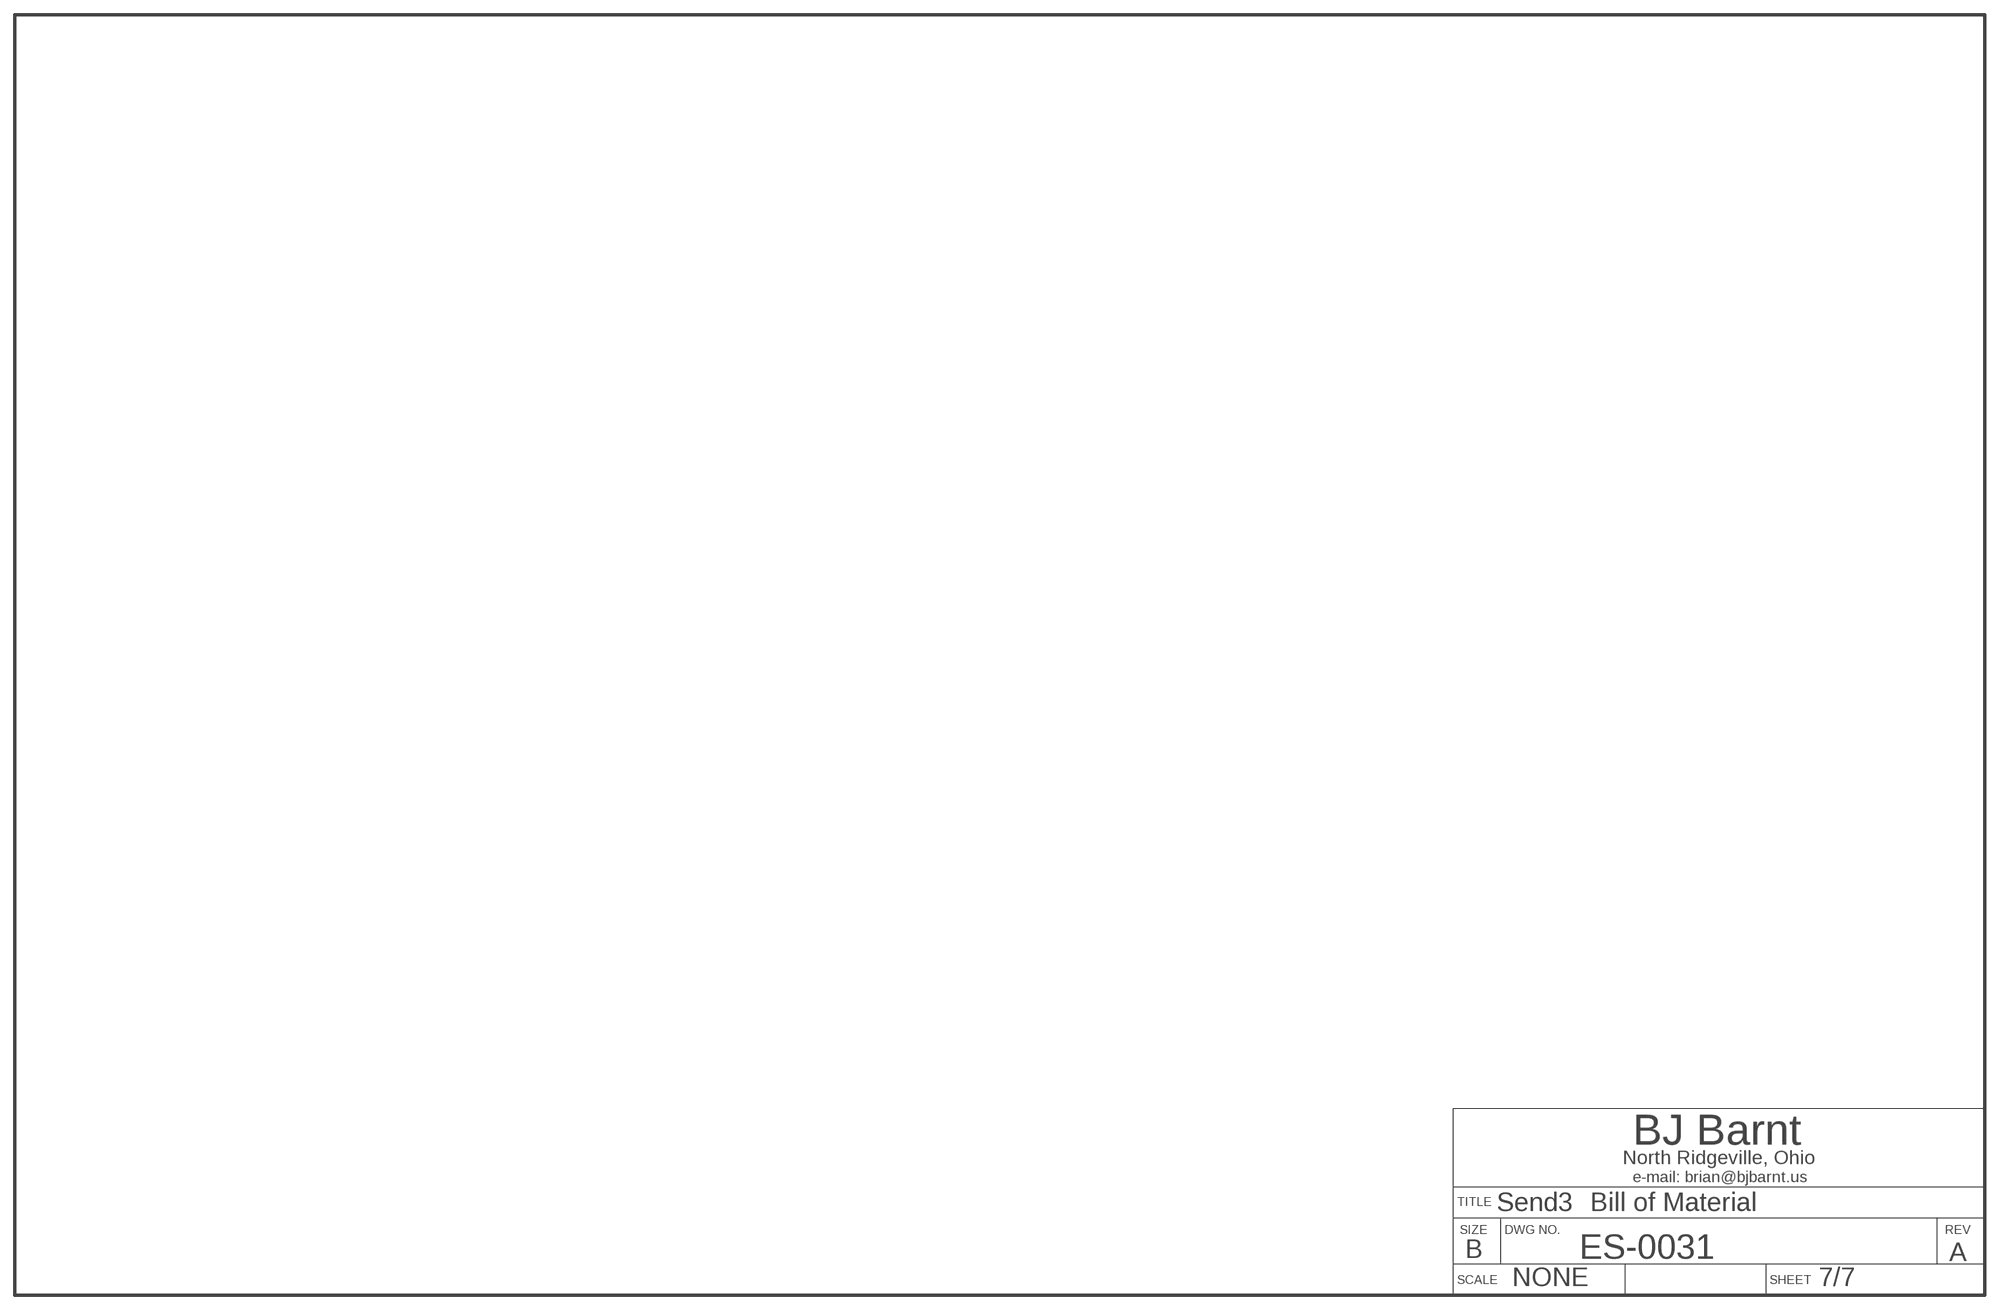
[diagram p6: schematic, sheet 7]

### Notes on the sheet
- Bill of Material
- ES-0031 | A

## Power pins joined to a net without a drawn wire
GND: U20.8(GND)
VCC: U20.16(VCC)

## Library data of the parts
C1 C2 C4-C10 C12-C20 = Project Lib:C-US: CAPACITOR, American symbol; DIST: Digikey; DIST_PN: PCC1828CT-ND; MFG: Panasonic; MFG_PN: ECJ-2VB1E104K
CON2 = pinhead:PINHD-2X13: PIN HEADER; DIST: Digikey; DIST_PN: S2211E-36-ND; MFG: Sullins; MFG_PN: PBC36DFAN
CON3 = pinhead:PINHD-2X5: PIN HEADER; REMARK: Supplied with CON2
JMPR2-JMPR8 = Project Lib:JUMPER
R1-R18 R27 = Project Lib:R-US_; DIST: Digikey; DIST_PN: P10KADCT-ND; MFG: Panasonic; MFG_PN: ERJ-P06J103V
U1 U20 = Project Lib:74*138: 3-line to 8-line DECODER/DEMULTIPLEXER; DIST: Digikey; DIST_PN: 296-4540-5-ND; MFG: Texas Instruments; MFG_PN: SN74AHC138D
U3 = Project Lib:AM26C32C; DIST: Digikey; DIST_PN: 296-6786-5-ND; MFG: Texas Instruments; MFG_PN: AM26C32CD
U4 = Project Lib:8255A: MICROCOMPUTER/PERIPHERAL DEVICE; DIST: Digikey; DIST_PN: CQ82C55AZ-ND; MFG: Intersil; MFG_PN: CQ82C55AZ
U5 = Project Lib:8254: Intersil 82C54 Timer; DIST: Digikey; DIST_PN: CS82C54-10Z96CT-ND; MFG: Intersil; MFG_PN: CS82C54-10Z96
U6 = Project Lib:74*540: Inverting Octal Buffer TI SN74HCT540DWR; DIST: Digikey; DIST_PN: 296-4605-1-ND; MFG: Texas Instruments; MFG_PN: SN74AHC540DWR
U7 = 74xx-us:74*273: Octal D type FLIP FLOP, clear; DIST: Digikey; DIST_PN: 296-26512-5-ND; MFG: Texas Instruments; MFG_PN: SN74LS273DW
U8 = Project Lib:74*166: 8-bit parallel load SHIFT REGISTER; DIST: Digikey; DIST_PN: 296-14839-1-ND; MFG: Texas Instruments; MFG_PN: SN74HC166DR
U9 U13 U17 = Project Lib:74*74: Dual D type positive edge triggered FLIP FLOP, preset and clear; DIST: Digikey; DIST_PN: 296-1105-1-ND; MFG: Texas Instruments; MFG_PN: SN74AHC74DR
U10 = Project Lib:74*08: Quad 2-input AND gate; DIST: Digikey; DIST_PN: 296-4523-1-ND; MFG: Texas Instruments; MFG_PN: SN74AHC08DR
U11 U18 = Project Lib:74*02: Quad 2-input NOR gate; DIST: Digikey; DIST_PN: 296-4511-1-ND; MFG: Texas Instruments; MFG_PN: SN74AHC02DR
U12 = Project Lib:74*00: Quad 2-input NAND gate; DIST: Digikey; DIST_PN: 296-4509-1-ND; MFG: Texas Instruments; MFG_PN: SN74AHC00DR
U14 = Project Lib:74*161; DIST: Digikey; DIST_PN: 296-4263-5-ND; MFG: Texas Instruments; MFG_PN: CD74ACT161M
U15 = Project Lib:74*04: Hex INVERTER; DIST: Digikey; DIST_PN: 296-4516-2-ND; MFG: Texas Instruments; MFG_PN: SN74AHC04DR
U16 = Project Lib:AM26C31C; DIST: Digikey; DIST_PN: 296-22029-1-ND; MFG: Texas Instruments; MFG_PN: AM26C31QDRG4
X1 = crystal:CRYSTAL_RES-: CRYSTAL RESONATOR; DIST: Digikey; DIST_PN: XC703CT-ND; MFG: ECS; MFG_PN: ECS-8FM-1.00000
X2 = Project Lib:PC104_CARD: PC/104 Standard 16 bit